# EAGLE design eeprom_burner (EAGLE 6.4)
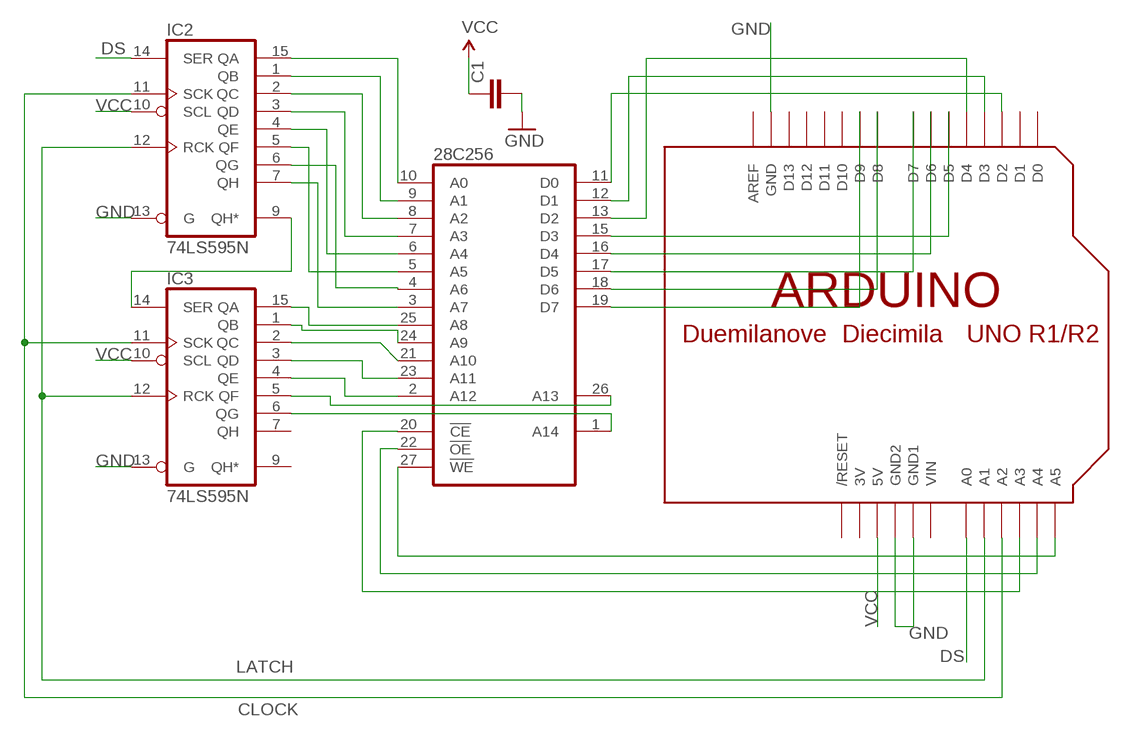
[diagram p0: schematic, sheet 1]

## Parts
28C256  2864  [DIL28]
C1  CAPPTH  [CAP-PTH-SMALL]
IC2  74LS595N  [DIL16]
IC3  74LS595N  [DIL16]
U$1  ARDUINOUNO  [ARDUINO]

## Nets
CLOCK: IC2.11(SCK) IC3.11(SCK) U$1.A2
DS: IC2.14(SER) U$1.A0
GND: C1.2 IC2.13(G) IC3.13(G) U$1.GND U$1.GND1 U$1.GND2
LATCH: IC2.12(RCK) IC3.12(RCK) U$1.A1
N$1: 28C256.27(!WE) U$1.A5
N$2: 28C256.22(!OE) U$1.A4
N$3: 28C256.20(!CE) U$1.A3
N$4: 28C256.11(D0) U$1.D2
N$5: 28C256.12(D1) U$1.D3
N$6: 28C256.13(D2) U$1.D4
N$7: 28C256.15(D3) U$1.D5
N$8: 28C256.16(D4) U$1.D6
N$9: 28C256.17(D5) U$1.D7
N$10: 28C256.18(D6) U$1.D8
N$11: 28C256.19(D7) U$1.D9
N$12: 28C256.10(A0) IC2.15(QA)
N$13: 28C256.9(A1) IC2.1(QB)
N$14: 28C256.8(A2) IC2.2(QC)
N$15: 28C256.7(A3) IC2.3(QD)
N$16: 28C256.6(A4) IC2.4(QE)
N$17: 28C256.5(A5) IC2.5(QF)
N$18: 28C256.4(A6) IC2.6(QG)
N$19: 28C256.3(A7) IC2.7(QH)
N$20: IC2.9(QH*) IC3.14(SER)
N$21: 28C256.25(A8) IC3.15(QA)
N$22: 28C256.24(A9) IC3.1(QB)
N$23: 28C256.21(A10) IC3.2(QC)
N$24: 28C256.23(A11) IC3.3(QD)
N$25: 28C256.2(A12) IC3.4(QE)
N$26: 28C256.26(A13) IC3.5(QF)
N$27: 28C256.1(A14) IC3.6(QG)
VCC: C1.1 IC2.10(SCL) IC3.10(SCL) U$1.5V
Unconnected: IC3.7(QH) IC3.9(QH*) U$1.AREF U$1.D0 U$1.D1 U$1.D10 U$1.D11 U$1.D12 U$1.D13 U$1.RESET(/RESET)

## Power pins joined to a net without a drawn wire
3V: U$1.3V
GND: 28C256.14(GND) IC2.8(GND) IC3.8(GND)
VCC: 28C256.28(VCC) IC2.16(VCC) IC3.16(VCC)
VIN: U$1.VIN

## Library data of the parts
28C256 = modded_memory:2864: MEMORY
C1 = SparkFun:CAP: Capacitor Standard 0603 ceramic capacitor, and 0.1" leaded capacitor.
IC2 IC3 = 74xx-us:74*595: 8-bit SHIFT REGISTER, output latch
U$1 = adafruit:ARDUINO: Arduino Diecimila/Duemilanove Make a shield with ease, this package has all the named pins as well as the two mounting drill holes and an outline of the USB and DC power connector. The outline is on the DIMENSION layer, so if your board house uses it they will cut the outline to match. http://www.ladyada.net/library/pcb/eaglelibrary.html

## Board
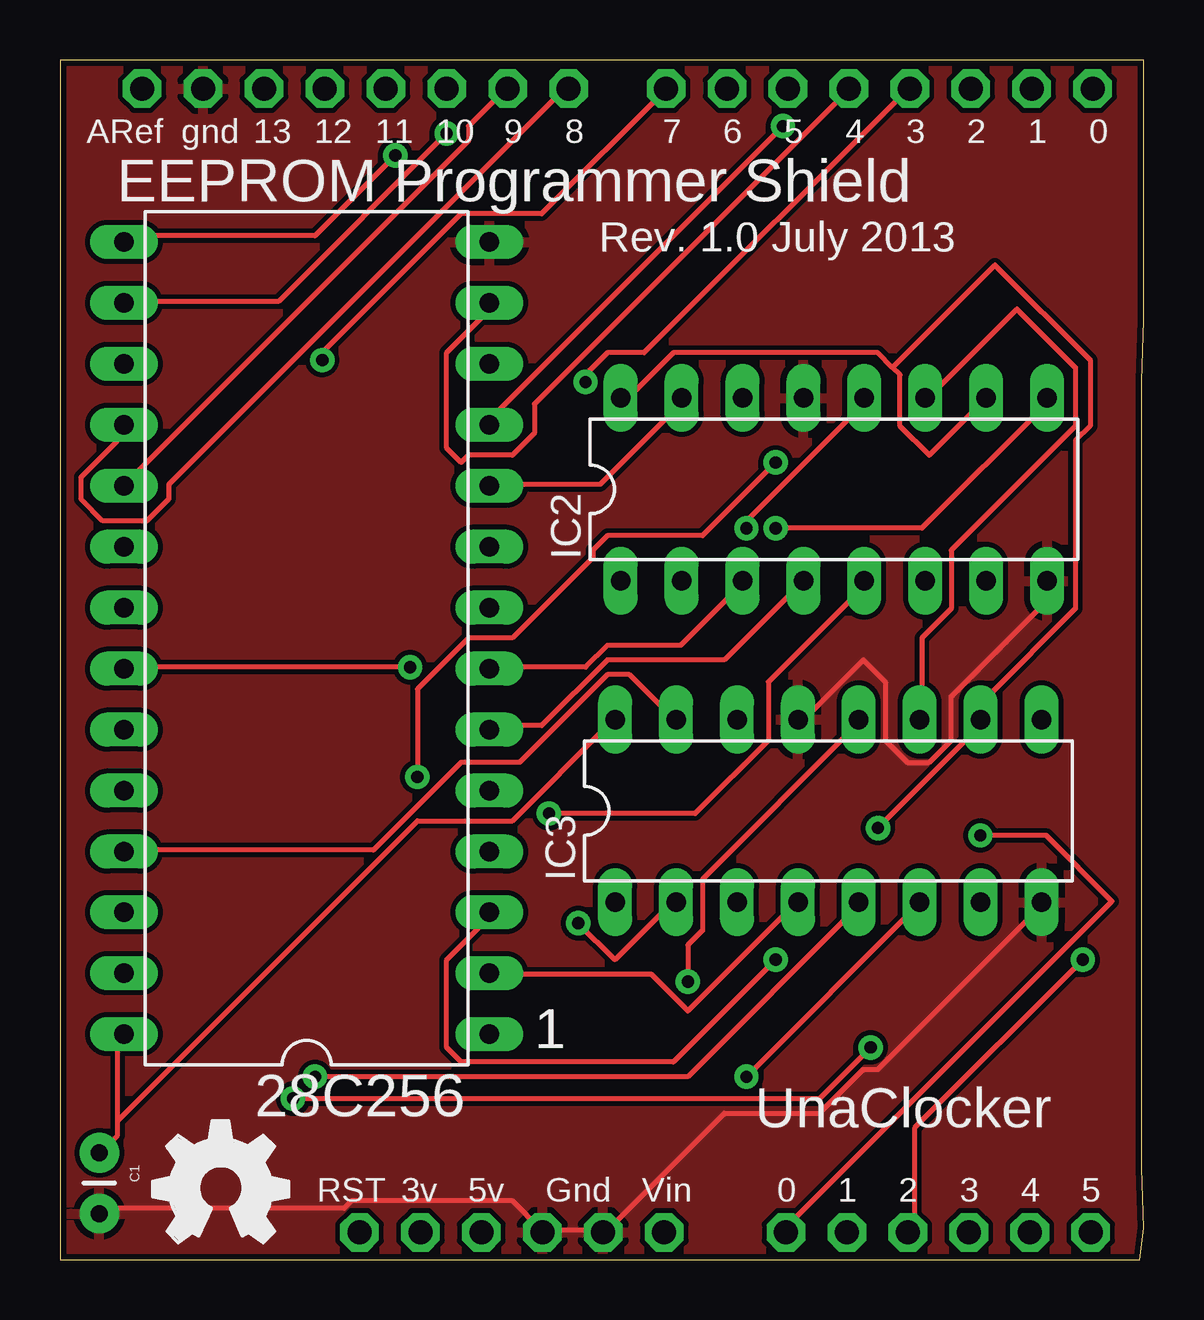
[diagram p1: board, top side]
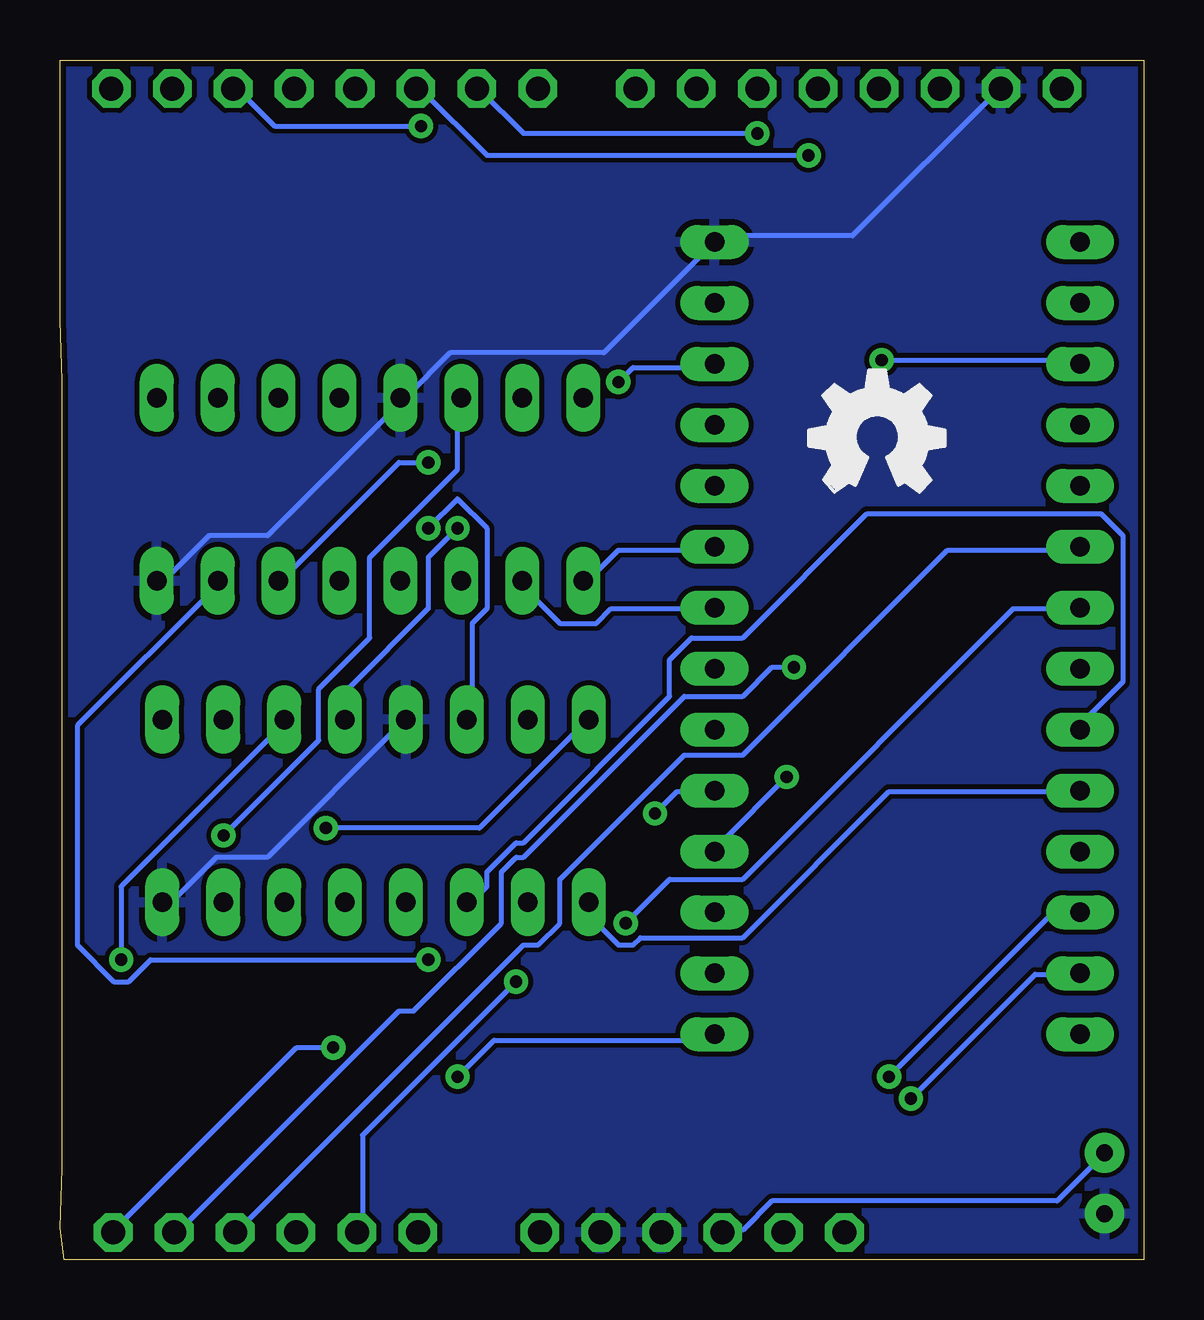
[diagram p2: board, bottom side, seen from below]

Size 45.19 x 50 mm. Coordinates in mm from the lower left corner, seen from the top.
Copper layers (1*16): Top 0.035mm / dielectric 1.5mm / Bottom 0.035mm
Design rules "SparkFun": minimum track width 8mil, minimum drill 20mil, track to track 8mil, track to pad 8mil, pad to pad 8mil, via to via 8mil, smd to smd 8mil, copper to edge 10mil, drill to drill 8mil, minimum pad ring 12mil, minimum via ring 10mil, stop-mask expansion 4mil, vias tented up to drill 25mil, thermal gap 10mil

### Footprints (pad centres in the part's own frame; a part is rotated, then mirrored left to right if it is on the bottom)
DIL28 = drill 0.813 long: 1 -16.51,-7.62; 2 -13.97,-7.62; 3 -11.43,-7.62; 4 -8.89,-7.62; 5 -6.35,-7.62; 6 -3.81,-7.62; 7 -1.27,-7.62; 8 1.27,-7.62; 9 3.81,-7.62; 10 6.35,-7.62; 11 8.89,-7.62; 12 11.43,-7.62; 13 13.97,-7.62; 14 16.51,-7.62; 15 16.51,7.62; 16 13.97,7.62; 17 11.43,7.62; 18 8.89,7.62; 19 6.35,7.62; 20 3.81,7.62; 21 1.27,7.62; 22 -1.27,7.62; 23 -3.81,7.62; 24 -6.35,7.62; 25 -8.89,7.62; 26 -11.43,7.62; 27 -13.97,7.62; 28 -16.51,7.62
CAP-PTH-SMALL = drill 0.7 pad 1.651: 1 0,0; 2 2.54,0
DIL16 = drill 0.813 long: 1 -8.89,-3.81; 2 -6.35,-3.81; 3 -3.81,-3.81; 4 -1.27,-3.81; 5 1.27,-3.81; 6 3.81,-3.81; 7 6.35,-3.81; 8 8.89,-3.81; 9 8.89,3.81; 10 6.35,3.81; 11 3.81,3.81; 12 1.27,3.81; 13 -1.27,3.81; 14 -3.81,3.81; 15 -6.35,3.81; 16 -8.89,3.81
ARDUINO = drill 1 pad 1.422 octagon: 3V 15.025,1.13; 5V 17.565,1.13; A0 30.265,1.13; A1 32.805,1.13; A2 35.345,1.13; A3 37.885,1.13; A4 40.425,1.13; A5 42.965,1.13; AREF 3.421,48.81; D0 43.045,48.81; D1 40.505,48.81; D2 37.965,48.81; D3 35.425,48.81; D4 32.885,48.81; D5 30.345,48.81; D6 27.805,48.81; D7 25.265,48.81; D8 21.201,48.81; D9 18.661,48.81; D10 16.121,48.81; D11 13.581,48.81; D12 11.041,48.81; D13 8.501,48.81; GND 5.961,48.81; GND1 22.645,1.13; GND2 20.105,1.13; RESET 12.485,1.13; VIN 25.185,1.13

### Placement (x,y rotation side)
28C256  10.28,25.9 90 top
C1  1.64,4.45 270 top
IC2  32.26,32.1 0 top
IC3  32.03,18.7 0 top
U$1  0,0 0 top
U$2  [OSHW_FILLX200_NOTEXT]  3.86,0.7 0 top
U$3  [OSHW_FILLX200_NOTEXT]  13.96,32 0 bottom

### Tracks (layer width: path | path; a pad name or v marks a point on that pad's centre or on a via)
CLOCK  (via drill 0.51)
  Top 0.203: IC3.11 35.93,22.55 35.93,25.91 37.15,27.13 37.15,29.57 42.33,34.75 42.33,37.19 39.89,39.62 36.23,35.97 IC2.11 | v42.63,12.5 35.62,5.49 35.62,1.22 U$1.A2
  Bottom 0.203: v42.63,12.5 42.63,15.54 35.93,22.25 IC3.11
DS  (via drill 0.51)
  Top 0.203: v38.37,17.68 41.11,17.68 43.85,14.94 30.14,1.22 U$1.A0
  Bottom 0.203: v38.37,17.68 34.4,21.64 34.4,23.77 32.27,25.91 32.27,29.26 28.61,32.92 28.61,35.66 IC2.14
GND
  Top 0.203: C1.2 1.79,2.13 11.85,2.13 12.15,2.44 18.86,2.44 20.08,1.22 U$1.GND2 20.38,1.22 22.52,1.22 U$1.GND1 22.82,1.22 27.7,6.1 31.66,6.1 33.49,7.92 34.1,7.92 40.8,14.63 IC3.8 | IC2.8 41.11,28.04 41.11,27.43 37.15,23.47 37.15,21.64 36.23,20.73 35.32,20.73 34.4,21.64 34.4,24.08 33.49,24.99 31.05,22.55 IC3.13
  Bottom 0.203: IC2.8 41.11,28.35 40.8,28.35 38.98,30.18 36.54,30.18 31.05,35.66 IC2.13 30.75,35.97 28.92,37.8 22.52,37.8 17.94,42.37 28C256.14 17.64,42.67 12.15,42.67 6.06,48.77 U$1.GND | IC3.8 40.8,14.94 40.5,14.94 38.67,16.76 36.54,16.76 31.05,22.25 IC3.13
  pour Bottom: -0.04,0 45.96,0 45.96,50 -0.04,50
  pour Top: -0.04,50 45.96,50 45.96,0 -0.04,0
LATCH  (via drill 0.51)
  Top 0.203: v28.61,30.48 28.61,30.79 33.49,35.66 IC2.12 | v26.17,11.58 26.17,13.11 26.78,13.72 26.78,15.85 33.18,22.25 IC3.12
  Bottom 0.203: v28.61,30.48 29.83,29.26 29.83,27.13 33.18,23.77 33.18,22.55 IC3.12 | v26.17,11.58 32.57,5.18 32.57,1.22 U$1.A1
N$1  (via drill 0.51)
  Top 0.203: v9.71,6.71 31.66,6.71 v33.79,8.84
  Bottom 0.203: v9.71,6.71 4.53,11.89 2.7,11.89 28C256.27 | v33.79,8.84 35.32,8.84 42.94,1.22 U$1.A5
N$2  (via drill 0.51)
  Top 0.203: v14.59,24.69 2.7,24.69 28C256.22
  Bottom 0.203: v14.59,24.69 15.51,24.69 16.72,23.47 19.16,23.47 25.87,16.76 26.17,16.76 26.78,16.15 26.78,14.02 30.44,10.36 31.05,10.36 40.2,1.22 U$1.A4
N$3
  Bottom 0.203: 28C256.20 2.7,29.57 8.19,29.57 16.72,21.03 19.16,21.03 24.34,15.85 24.34,14.02 25.26,13.11 25.87,13.11 37.76,1.22 U$1.A3
N$4  (via drill 0.51)
  Top 0.203: v30.14,47.24 17.94,35.05 28C256.11
  Bottom 0.203: v30.14,47.24 36.23,47.24 37.76,48.77 U$1.D2
N$5  (via drill 0.51)
  Top 0.203: v21.91,36.58 21.91,36.88 22.82,37.8 24.34,37.8 35.32,48.77 U$1.D3
  Bottom 0.203: v21.91,36.58 21.3,37.19 17.94,37.19 28C256.12
N$6
  Top 0.203: 28C256.13 17.64,39.62 17.64,39.32 16.11,37.8 16.11,33.83 16.72,33.22 17.03,33.53 18.86,33.53 19.77,34.44 19.77,35.66 32.88,48.77 U$1.D4
N$7  (via drill 0.51)
  Top 0.203: v13.98,46.02 10.63,42.67 2.7,42.67 28C256.15
  Bottom 0.203: v13.98,46.02 27.39,46.02 30.14,48.77 U$1.D5
N$8  (via drill 0.51)
  Top 0.203: v16.11,46.94 9.11,39.93 2.7,39.93 28C256.16
  Bottom 0.203: v16.11,46.94 25.87,46.94 27.7,48.77 U$1.D6
N$9  (via drill 0.51)
  Top 0.203: v10.93,37.49 10.93,37.8 16.72,43.59 20.08,43.59 25.26,48.77 U$1.D7
  Bottom 0.203: v10.93,37.49 2.7,37.49 28C256.17
N$10
  Top 0.203: 28C256.18 2.4,34.75 2.4,34.14 0.88,32.61 0.88,31.7 1.79,30.79 3.62,30.79 4.53,31.7 4.53,32.31 20.99,48.77 U$1.D8
N$11
  Top 0.203: 28C256.19 2.7,32.31 17.03,46.63 17.03,47.24 18.55,48.77 U$1.D9
N$12
  Top 0.203: 28C256.10 17.94,32.31 22.52,32.31 25.87,35.66 IC2.15
N$13
  Bottom 0.203: 28C256.9 17.94,29.57 21.91,29.57 23.13,28.35 IC2.1
N$14
  Bottom 0.203: 28C256.8 17.94,27.13 22.21,27.13 22.82,26.52 24.34,26.52 25.87,28.04 IC2.2
N$15
  Top 0.203: 28C256.7 17.94,24.69 21.91,24.69 22.82,25.6 25.87,25.6 28.31,28.04 IC2.3
N$16
  Top 0.203: 28C256.6 17.94,22.25 20.08,22.25 22.82,24.99 27.7,24.99 30.75,28.04 IC2.4
N$17  (via drill 0.51)
  Top 0.203: v20.38,18.59 26.48,18.59 29.53,21.64 29.53,24.08 33.49,28.04 IC2.5
  Bottom 0.203: v20.38,18.59 19.47,19.51 17.94,19.51 28C256.5
N$18  (via drill 0.51)
  Top 0.203: v14.9,20.12 14.9,23.77 17.03,25.91 18.86,25.91 22.21,29.26 22.21,29.57 22.82,30.18 26.78,30.18 v29.83,33.22
  Bottom 0.203: v14.9,20.12 17.64,17.37 17.64,17.07 28C256.4 | v29.83,33.22 31.05,33.22 35.93,28.35 IC2.6
N$19  (via drill 0.51)
  Top 0.203: v29.83,12.5 25.56,8.23 16.72,8.23 16.11,8.84 16.11,12.5 17.64,14.02 17.64,14.33 28C256.3
  Bottom 0.203: v29.83,12.5 41.41,12.5 42.33,11.58 42.94,11.58 44.46,13.11 44.46,22.25 38.67,28.04 IC2.7
N$20  (via drill 0.51)
  Top 0.203: v29.83,30.48 35.93,30.48 41.11,35.66 IC2.9
  Bottom 0.203: v29.83,30.48 28.61,31.7 27.39,30.48 27.39,27.13 28,26.52 28,22.55 IC3.14
N$21
  Top 0.203: 28C256.25 2.7,17.07 13.07,17.07 16.72,20.73 19.16,20.73 22.82,24.38 23.73,24.38 25.56,22.55 IC3.15
N$22
  Bottom 0.203: 28C256.24 2.7,19.51 10.63,19.51 16.72,13.41 20.99,13.41 21.3,13.11 21.91,13.11 23.43,14.63 IC3.1
N$23  (via drill 0.51)
  Top 0.203: v21.6,14.02 23.13,12.5 25.56,14.94 IC3.2
  Bottom 0.203: v21.6,14.02 19.77,15.85 16.72,15.85 5.45,27.13 2.7,27.13 28C256.21
N$24
  Bottom 0.203: 28C256.23 2.4,22.25 2.4,22.55 0.88,24.08 0.88,30.18 1.79,31.09 11.54,31.09 16.72,25.91 18.86,25.91 19.77,24.99 19.77,23.47 25.87,17.37 26.17,17.37 27.39,16.15 27.39,15.54 28,14.94 IC3.3
N$25
  Top 0.203: 28C256.2 17.94,11.89 24.65,11.89 26.17,10.36 30.75,14.94 IC3.4
N$26  (via drill 0.51)
  Top 0.203: v10.63,7.62 26.17,7.62 33.18,14.63 IC3.5
  Bottom 0.203: v10.63,7.62 3.92,14.33 2.7,14.33 28C256.26
N$27  (via drill 0.51)
  Top 0.203: v28.61,7.62 35.62,14.63 IC3.6
  Bottom 0.203: v28.61,7.62 27.09,9.14 17.94,9.14 28C256.1
VCC  (via drill 0.51)
  Top 0.203: 34.71,37.19 35.01,36.88 35.01,34.75 36.23,33.53 38.37,35.66 IC2.10 | 34.71,37.19 34.1,37.8 25.56,37.8 23.73,35.97 23.43,35.97 IC2.16 | 34.71,37.19 38.98,41.45 42.94,37.49 42.94,34.75 42.33,34.14 42.33,27.13 38.67,23.47 38.67,22.55 IC3.10 38.37,22.25 v34.1,17.98 | 2.4,5.79 2.4,5.18 1.79,4.57 C1.1 | 2.4,5.79 2.4,9.14 28C256.28 | 2.4,5.79 14.9,18.29 18.86,18.29 22.82,22.25 23.13,22.25 IC3.16
  Bottom 0.203: U$1.5V 17.33,1.22 16.72,1.22 15.51,2.44 3.62,2.44 1.79,4.27 C1.1 | v34.1,17.98 27.7,17.98 23.43,22.25 IC3.16

### Text on the board
tNames: EEPROM Programmer Shield | Rev. 1.0 July 2013 | 1 | UnaClocker